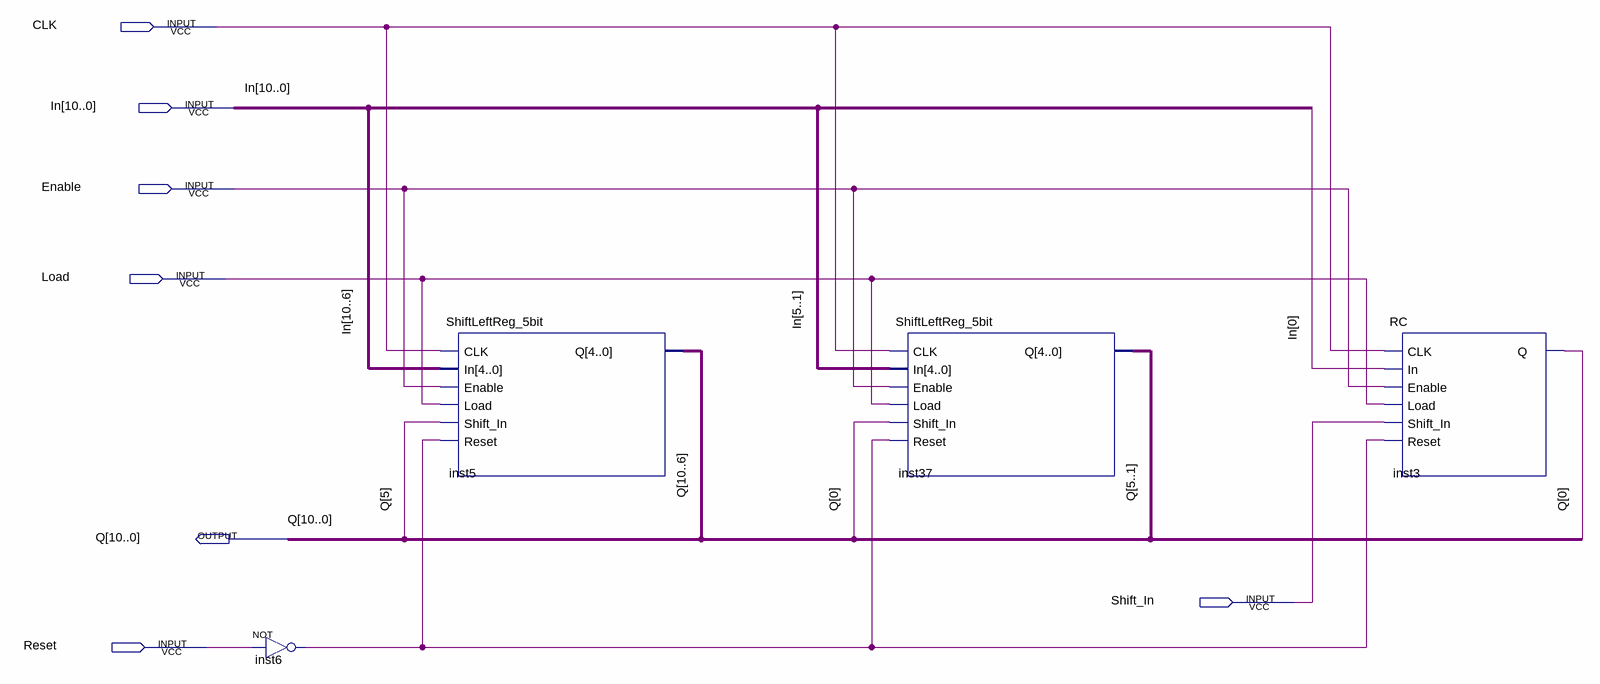
[diagram p0: schematic sheet]
// Quartus schematic ShiftLeftReg_11bit.bdf as structural Verilog: 4 symbols, 7 pins
module ShiftLeftReg_11bit (
  input  CLK,
  input  [10:0] In,
  input  Enable,
  input  Load,
  input  Shift_In,
  input  Reset,
  output [10:0] Q
);

  wire inst6_out;

  not inst6 (inst6_out, Reset);
  ShiftLeftReg_5bit inst5 (
    .CLK(CLK), .In(In[10:6]), .Enable(Enable), .Load(Load), .Shift_In(Q[5]), .Reset(inst6_out), .Q(Q[10:6]));
  ShiftLeftReg_5bit inst37 (
    .CLK(CLK), .In(In[5:1]), .Enable(Enable), .Load(Load), .Shift_In(Q[0]), .Reset(inst6_out), .Q(Q[5:1]));
  RC inst3 (.CLK(CLK), .In(In[0]), .Enable(Enable), .Load(Load), .Shift_In(Shift_In), .Reset(inst6_out), .Q(Q[0]));
endmodule
